# Altium schematic sheet LoRaB.SchDoc
size A4; SheetNumber: 3; SheetTotal: 3
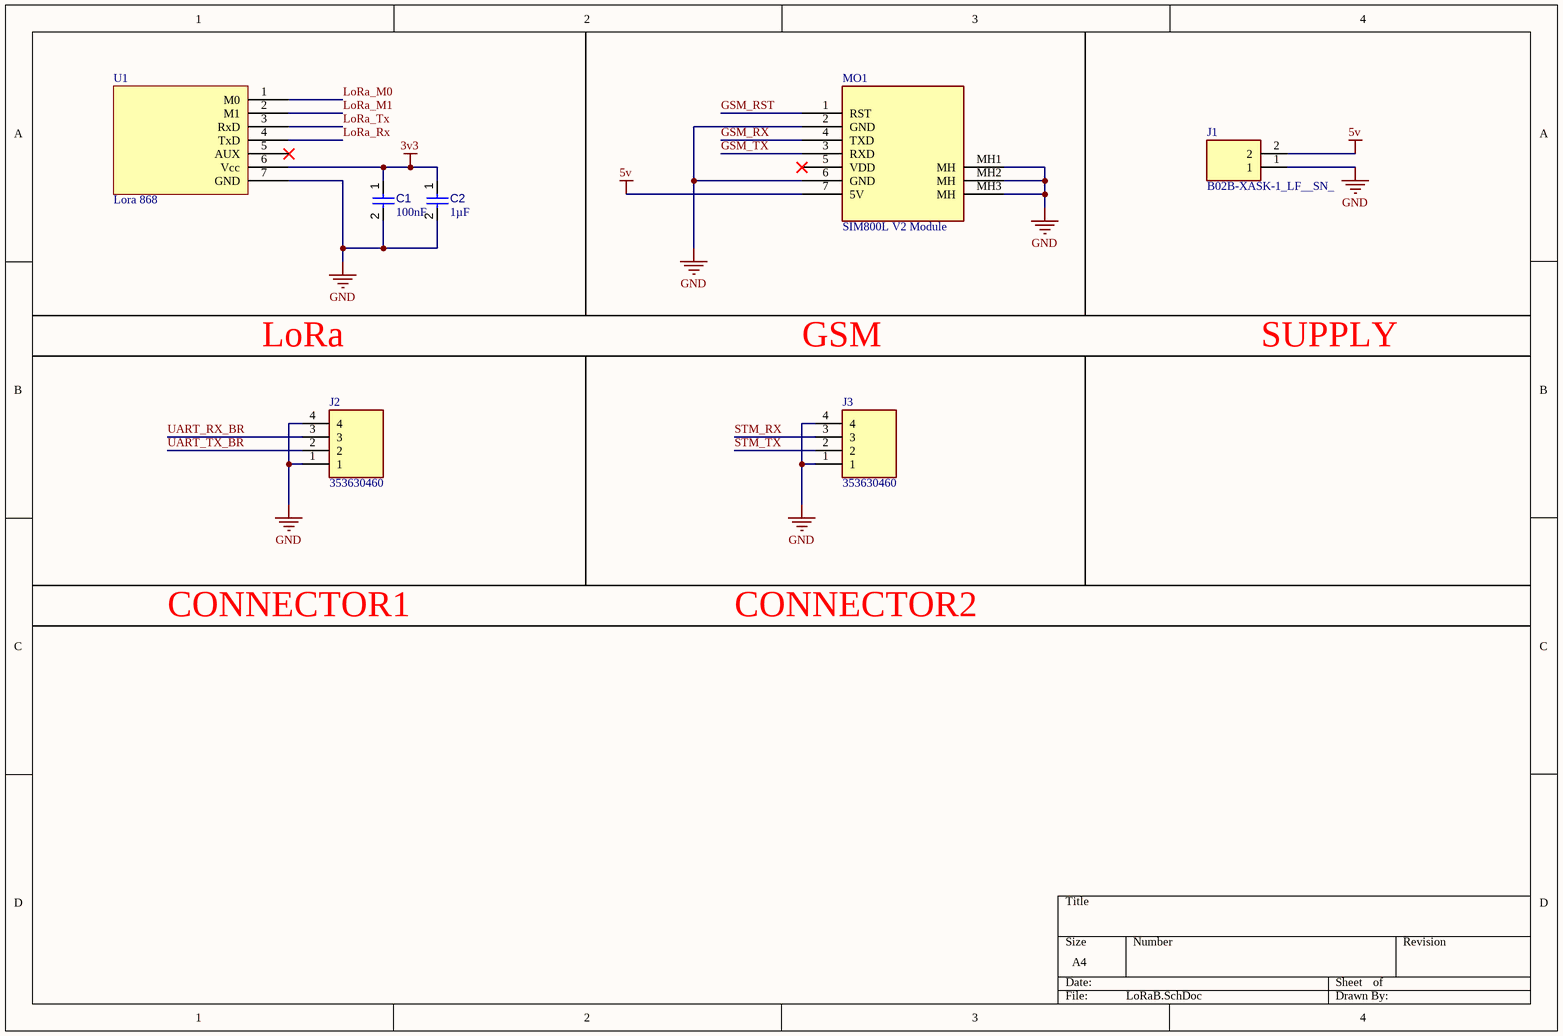
[diagram p0: LoRaB.SchDoc]

## Parts
C1  value 100nF  [CAPC1608X90X40NL10T20]  (hidden comment: Capacitor 100 nF +/-10% 50 V 0603)
C2  value 1µF  [CAPC2013X135X45NL10T25]  (hidden comment: Capacitor 1 uF +/- 10% 50 V 0805)
J1  B02B-XASK-1_LF__SN_  [SHDR2W60P0X250_1X2_750X640X880P]
J2  353630460  [353630460]
J3  353630460  [353630460]
MO1  SIM800L V2 Module  [SIM800LV2.0]
U1  Lora 868  [Lora 833]

## Nets
3v3: C1.1 C2.1 U1.6(Vcc)
5v: J1.2 MO1.7(5V)
GND: C1.2 C2.2 J1.1 J2.1 J2.4 J3.1 J3.4 MO1.2(GND) MO1.6(GND) MO1.MH1(MH) MO1.MH2(MH) MO1.MH3(MH) U1.7(GND)
GSM_RST: MO1.1(RST)
GSM_RX: MO1.4(TXD)
GSM_TX: MO1.3(RXD)
LoRa_M0: U1.1(M0)
LoRa_M1: U1.2(M1)
LoRa_Rx: U1.4(TxD)
LoRa_Tx: U1.3(RxD)
STM_RX: J3.3
STM_TX: J3.2
UART_RX_BR: J2.3
UART_TX_BR: J2.2

Not connected (* = marked no-connect by the designer): MO1 5(VDD)*; U1 5(AUX)*

## Notes on the sheet
- LoRa
- GSM
- SUPPLY
- CONNECTOR1
- CONNECTOR2

## Library data of the parts
C1 = CMP-001-00017-6: Chip Capacitor, 100 nF, +/- 10%, 50 V, 0603 (1608 Metric); Voltage Rating: 50V; Capacitor Type: Ceramic; Tolerance: 10%; Mounting Technology: SM; Max Operating Temperature: 125°C; RoHS Compliant: True; Pins: 2; Case/Package: 0603; Min Operating Temperature: -55°C
C2 = CMP-001-00007-6: Chip Capacitor, 1 uF, +/- 10%, 50 V, 0805 (2012 Metric); Capacitor Type: Ceramic; Voltage Rating: 50V; Min Operating Temperature: -55°C; RoHS Compliant: True; Mounting Technology: SM; Case/Package: 0805; Max Operating Temperature: 125°C; Tolerance: 10%; Pins: 2
J1 = B02B-XASK-1_LF__SN_: Connector; Manufacturer_Name: JST (JAPAN SOLDERLESS TERMINALS); Manufacturer_Part_Number: B02B-XASK-1(LF)(SN); Datasheet Link: http://www.jst-mfg.com/product/pdf/eng/eXA1.pdf; Height: 8.8mm; Mouser Part Number: N/A; Mouser Price/Stock: https://www.mouser.co.uk/ProductDetail/JST-Commercial/B02B-XASK-1LFSN?qs=IKkN%2F947nfBty2GocXf7QA%3D%3D; Arrow Part Number: B02B-XASK-1(LF)(SN); Arrow Price/Stock: https://www.arrow.com/en/products/b02b-xask-1-lf-sn/jst-manufacturing?utm_currency=USD&region=europe
J2 J3 = 353630460: Connector; Manufacturer_Name: Molex; Datasheet Link: https://www.molex.com/pdm_docs/sd/353630260_sd.pdf; Height: 5.5mm; Manufacturer_Part_Number: 353630460; Arrow Part Number: 353630460; Arrow Price/Stock: https://www.arrow.com/en/products/35363-0460/molex?region=nac
MO1 = SIM800LV2.0: GSM Module
U1 = Lora 833